# EAGLE design Adafruit OLED FeatherWing (EAGLE 6.4)
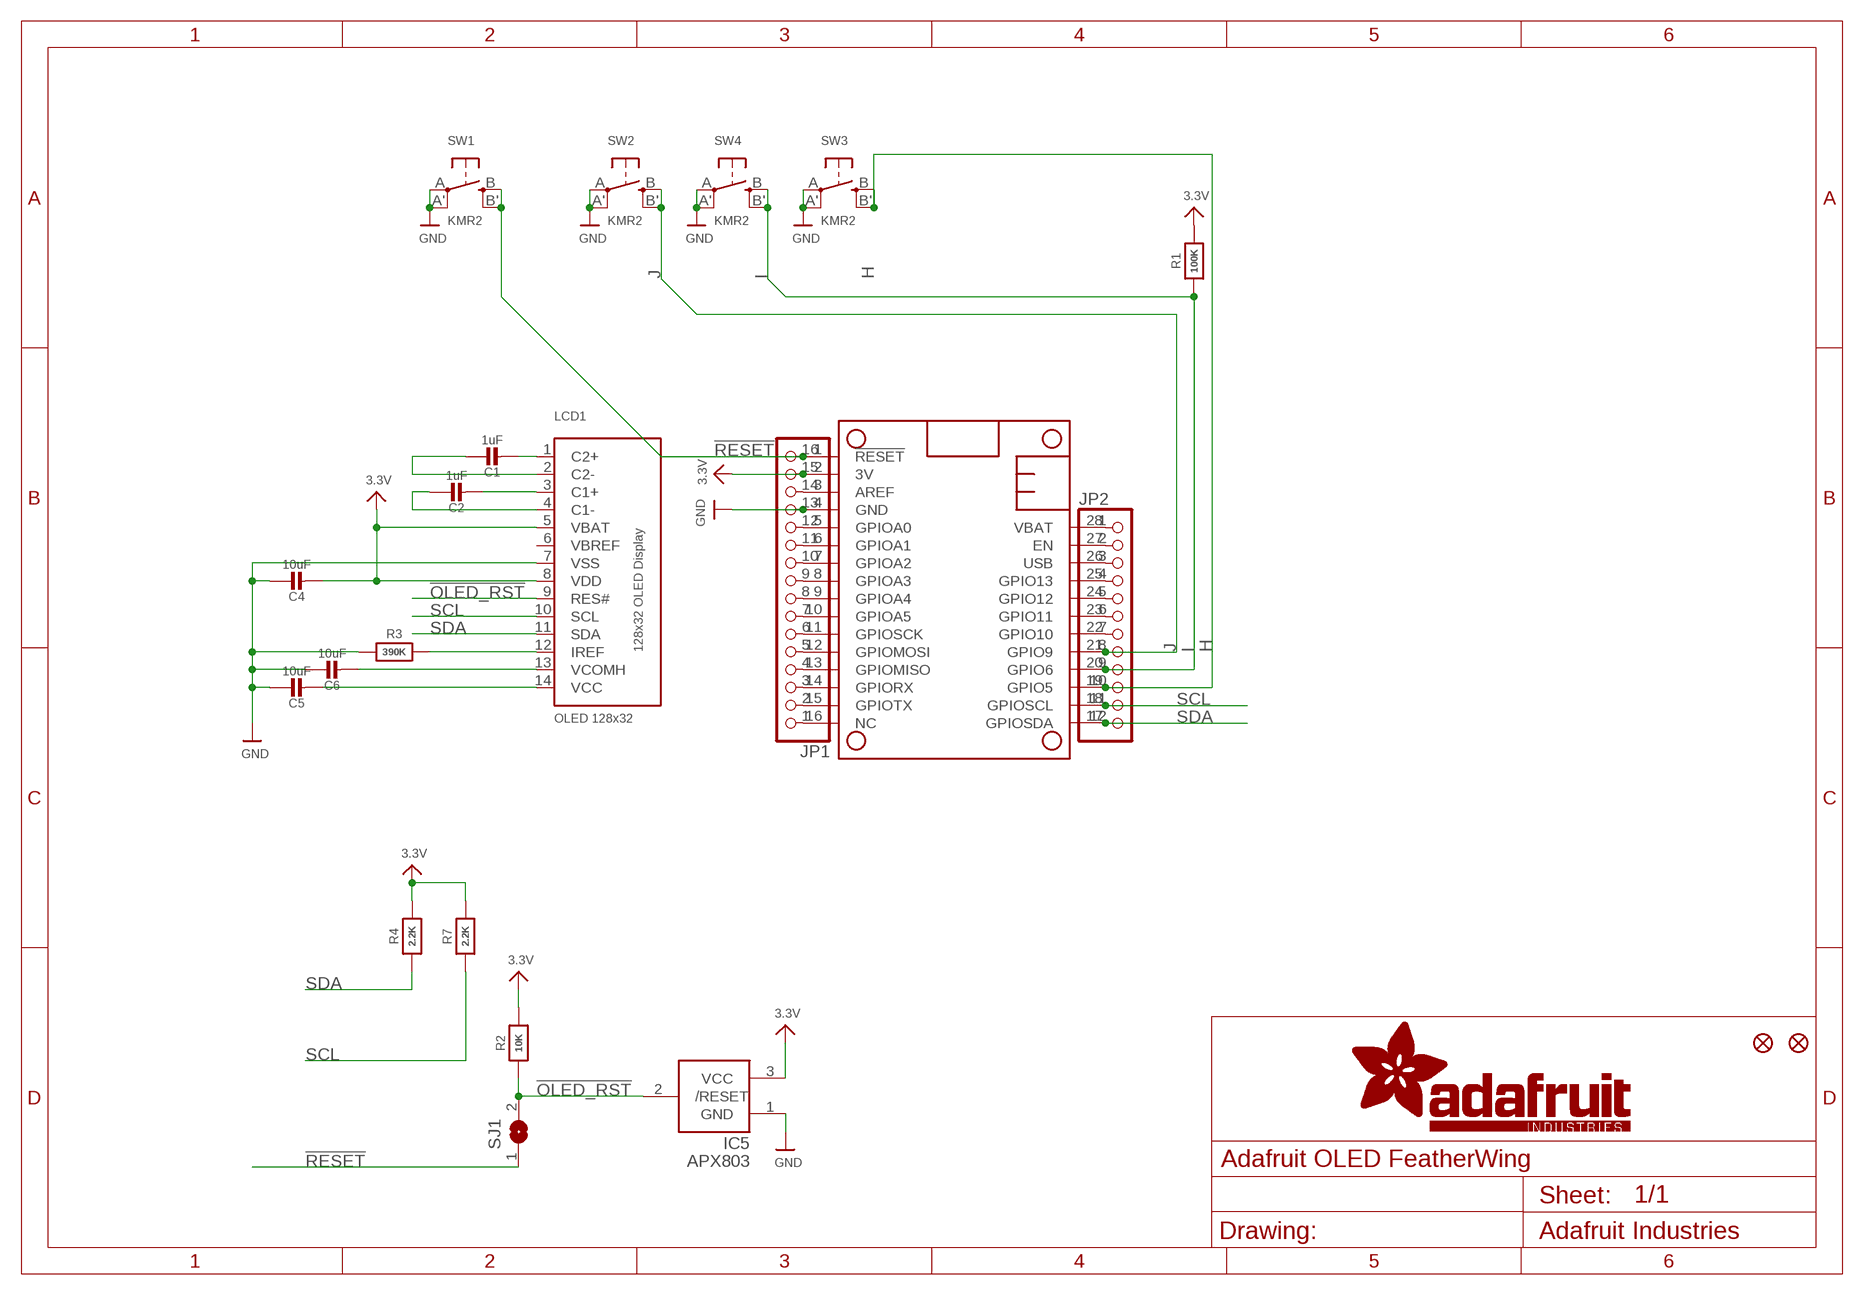
[diagram p0: schematic, sheet 1]

## Parts
C1  1uF  CAP_CERAMIC0805-NOOUTLINE  [0805-NO]
C2  1uF  CAP_CERAMIC0805-NOOUTLINE  [0805-NO]
C4  10uF  CAP_CERAMIC0805-NOOUTLINE  [0805-NO]
C5  10uF  CAP_CERAMIC0805-NOOUTLINE  [0805-NO]
C6  10uF  CAP_CERAMIC0805-NOOUTLINE  [0805-NO]
FID1  FIDUCIAL""  [FIDUCIAL_1MM]
FID2  FIDUCIAL""  [FIDUCIAL_1MM]
IC5  APX803  AXP083-SAG  [SOT23]
JP1  HEADER-1X16ROUND  [1X16_ROUND]
JP2  HEADER-1X12  [1X12_ROUND]
LCD1  OLED 128x32  DISP_OLED_UG-2832HSWEG02  [UG-2832HSWEG02_WRAPUNDER]
MS1  FEATHERWING  [FEATHERWING]
R1  100K  RESISTOR0805_NOOUTLINE  [0805-NO]
R2  10K  RESISTOR_0805MP  [_0805MP]
R3  390K  RESISTOR0805_NOOUTLINE  [0805-NO]
R4  2.2K  RESISTOR0805_NOOUTLINE  [0805-NO]
R7  2.2K  RESISTOR0805_NOOUTLINE  [0805-NO]
SJ1  SOLDERJUMPER  [SOLDERJUMPER_ARROW_NOPASTE]
SW1  KMR2  SWITCH_TACT_SMT4.6X2.8  [BTN_KMR2_4.6X2.8]
SW2  KMR2  SWITCH_TACT_SMT4.6X2.8  [BTN_KMR2_4.6X2.8]
SW3  KMR2  SWITCH_TACT_SMT4.6X2.8  [BTN_KMR2_4.6X2.8]
SW4  KMR2  SWITCH_TACT_SMT4.6X2.8  [BTN_KMR2_4.6X2.8]

## Nets
3.3V: C4.2 IC5.3(VCC) JP1.15 LCD1.5(VBAT) LCD1.8(VDD) MS1.2(3V) R1.2 R2.2 R4.2 R7.2
!OLED_RST: IC5.2(/RESET) LCD1.9(RES#) R2.1 SJ1.2
!RESET: JP1.16 MS1.1(!RESET) SJ1.1 SW1.B'(S1) SW1.B(S)
A: JP1.12 MS1.5(GPIOA0)
AREF: JP1.14 MS1.3(AREF)
B: JP1.11 MS1.6(GPIOA1)
C: JP1.10 MS1.7(GPIOA2)
D: JP1.9 MS1.8(GPIOA3)
E: JP1.8 MS1.9(GPIOA4)
EN: JP2.2 MS1.27(EN)
F: JP1.7 MS1.10(GPIOA5)
G: JP1.1 MS1.16(NC)
GND: C4.1 C5.1 C6.1 IC5.1(GND) JP1.13 LCD1.7(VSS) MS1.4(GND) R3.1 SW1.A'(P1) SW1.A(P) SW2.A'(P1) SW2.A(P) SW3.A'(P1) SW3.A(P) SW4.A'(P1) SW4.A(P)
H: JP2.10 MS1.19(GPIO5) SW3.B'(S1) SW3.B(S)
I: JP2.9 MS1.20(GPIO6) R1.1 SW4.B'(S1) SW4.B(S)
J: JP2.8 MS1.21(GPIO9) SW2.B'(S1) SW2.B(S)
K: JP2.7 MS1.22(GPIO10)
L: JP2.6 MS1.23(GPIO11)
M: JP2.5 MS1.24(GPIO12)
MISO: JP1.4 MS1.13(GPIOMISO)
MOSI: JP1.5 MS1.12(GPIOMOSI)
N: JP2.4 MS1.25(GPIO13)
N$1: C1.2 LCD1.1(C2+)
N$2: C1.1 LCD1.2(C2-)
N$3: C2.2 LCD1.3(C1+)
N$4: C2.1 LCD1.4(C1-)
N$5: C6.2 LCD1.13(VCOMH)
N$6: C5.2 LCD1.14(VCC)
N$7: LCD1.12(IREF) R3.2
RX: JP1.3 MS1.14(GPIORX)
SCK: JP1.6 MS1.11(GPIOSCK)
SCL: JP2.11 LCD1.10(SCL) MS1.18(GPIOSCL) R7.1
SDA: JP2.12 LCD1.11(SDA) MS1.17(GPIOSDA) R4.1
TX: JP1.2 MS1.15(GPIOTX)
USB: JP2.3 MS1.26(USB)
VBAT: JP2.1 MS1.28(VBAT)

## Power pins joined to a net without a drawn wire
VBREF: LCD1.6(VBREF)

## Library data of the parts
C1 C2 C4-C6 = microbuilder:CAP_CERAMIC: Ceramic Capacitors For new designs, use the packages preceded by an '_' character since they are more reliable: The following footprints should be used on most boards: _0402 - Standard footprint for regular board layouts _0603 - Standard footprint for regular board layouts _0805 - Standard footprint for regular board layouts _1206 - Standard footprint for regular board layouts For extremely tight-pitch boards where space is at a premium, the following 'micro-pitch' footprints can be used (smaller pads, no silkscreen outline, etc.): _0402MP - Micro-pitch footprint for very dense/compact boards _0603MP - Micro-pitch footprint for very dense/compact boards _0805MP - Micro-pitch footprint for very dense/compact boards _1206MP - Micro-pitch footprint for very dense/compact boards
FID1 FID2 = microbuilder:FIDUCIAL: Fiducial Alignment Points Various fiducial points for machine vision alignment.; BOM: EXCLUDE
IC5 = adafruit:AXP083
JP1 = microbuilder:HEADER-1X16: PIN HEADER
JP2 = microbuilder:HEADER-1X12
LCD1 = microbuilder:DISP_OLED_UG-2832HSWEG02: 128x32 I2C 0.91" Monochrome OLED Display
MS1 = microbuilder:FEATHERWING
R1-R4 R7 = microbuilder:RESISTOR: Resistors For new designs, use the packages preceded by an '_' character since they are more reliable: The following footprints should be used on most boards: _0402 - Standard footprint for regular board layouts _0603 - Standard footprint for regular board layouts _0805 - Standard footprint for regular board layouts _1206 - Standard footprint for regular board layouts For extremely tight-pitch boards where space is at a premium, the following 'micro-pitch' footprints can be used (smaller pads, no silkscreen outline, etc.): _0402MP - Micro-pitch footprint for very dense/compact boards _0603MP - Micro-pitch footprint for very dense/compact boards _0805MP - Micro-pitch footprint for very dense/compact boards _1206MP - Micro-pitch footprint for very dense/compact boards
SJ1 = microbuilder:SOLDERJUMPER: SMD Solder JUMPER Solder the two pads together to create a connection, or remove the solder to break it. REFLOW - Use this footprint for solder paste and reflow ovens. WAVE - Use this footprint for hand-soldering (larger pads). CLOSED - Has a trace between the two pads to ensure it is closed by default. The trace needs to be cut to disable the jumper, and can be closed again by creating a solder bridge between the two pads.; BOM: EXCLUDE
SW1-SW4 = microbuilder:SWITCH_TACT_SMT: SMT Tact Switches 6x6mm - Digikey: P12940SCT-ND KMR2 (4.6x2.8mm) - Digikey: 401-1426-1-ND EVQ-PQHB55 - Light Touch, 160GF (4.5x4.5mm) - Digikey: P8090SCT-ND KMT0 - KMT021 NGJ LHS (etc.) IP68/Waterproof - Digikey: CKN10289CT-ND

## Board
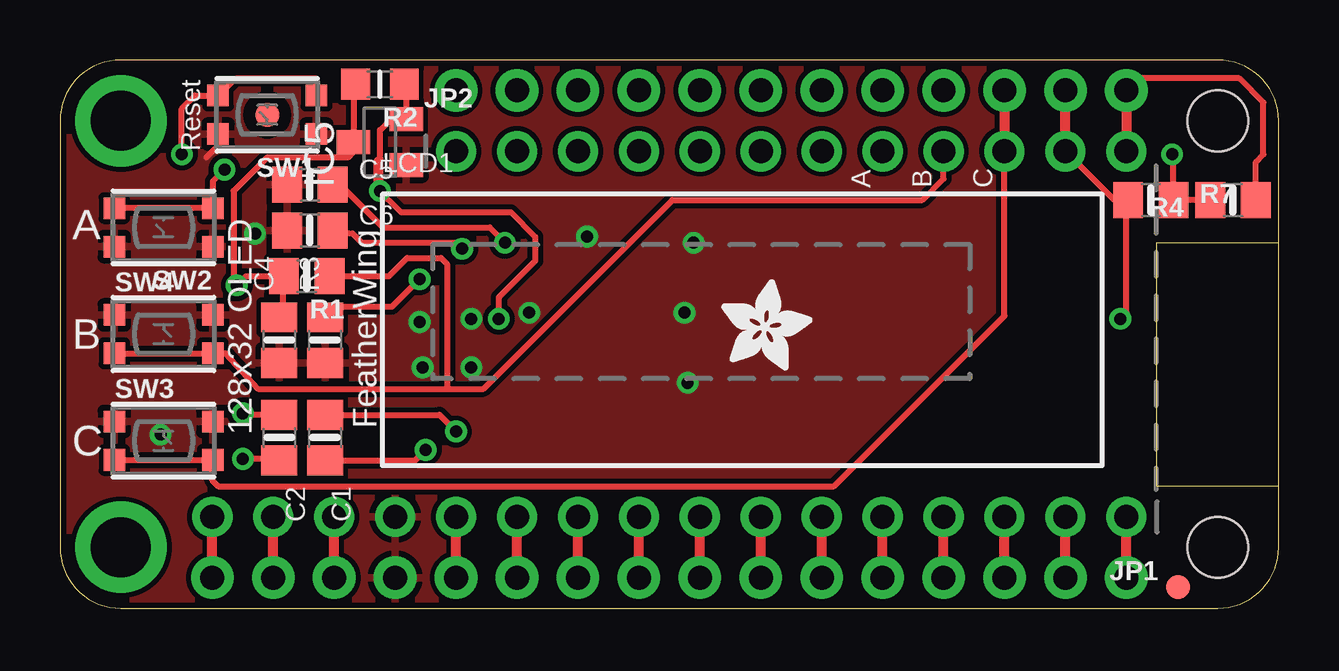
[diagram p1: board, top side]
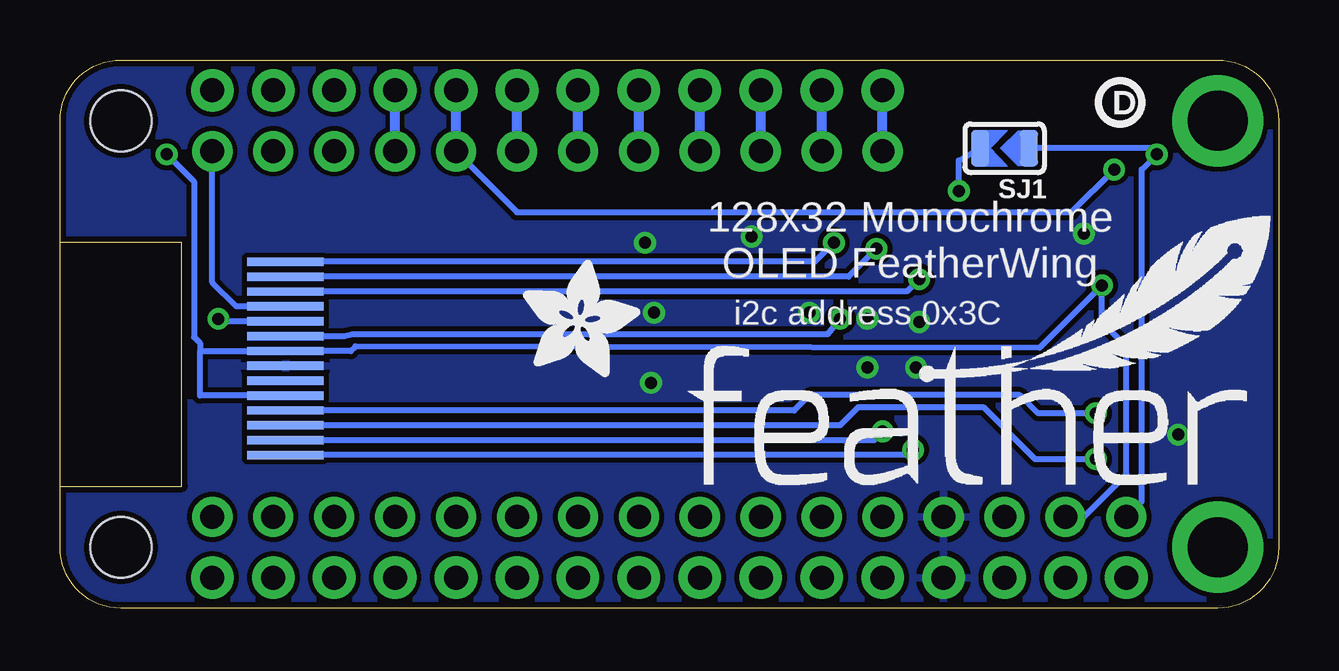
[diagram p2: board, bottom side, seen from below]

Size 50.8 x 22.86 mm. Coordinates in mm from the lower left corner, seen from the top.
Outline: 50.8,15.24 50.8,20.32 arc90 48.26,22.86 2.54,22.86 arc90 0,20.32 0,2.54 arc90 2.54,0 48.26,0 arc90 50.8,2.54 50.8,5.08 45.72,5.08 45.72,15.24 50.8,15.24
Copper layers (1*16): Top 0.035mm / dielectric 1.5mm / Bottom 0.035mm
Design rules "adafruit": minimum track width 8mil, minimum drill 15.5mil, track to track 8mil, track to pad 8mil, pad to pad 8mil, via to via 8mil, smd to smd 8mil, copper to edge 10mil, drill to drill 8mil, minimum pad ring 10mil, minimum via ring 8mil, stop-mask expansion 2mil, vias tented up to drill 20mil, thermal gap 10mil

### Footprints (pad centres in the part's own frame; a part is rotated, then mirrored left to right if it is on the bottom)
0805-NO = smd 1.24 x 1.5: 1 -0.95,0; 2 0.95,0
FIDUCIAL_1MM = smd 1 x 1: 1 0,0
SOT23 = smd 1 x 1.4: 1 -0.95,-1.1; 2 0.95,-1.1; 3 0,1.1
1X16_ROUND = drill 1 pad 1.676: 1 -19.05,0; 2 -16.51,0; 3 -13.97,0; 4 -11.43,0; 5 -8.89,0; 6 -6.35,0; 7 -3.81,0; 8 -1.27,0; 9 1.27,0; 10 3.81,0; 11 6.35,0; 12 8.89,0; 13 11.43,0; 14 13.97,0; 15 16.51,0; 16 19.05,0
1X12_ROUND = drill 1 pad 1.676: 1 -13.97,0; 2 -11.43,0; 3 -8.89,0; 4 -6.35,0; 5 -3.81,0; 6 -1.27,0; 7 1.27,0; 8 3.81,0; 9 6.35,0; 10 8.89,0; 11 11.43,0; 12 13.97,0
UG-2832HSWEG02_WRAPUNDER = smd 3.2 x 0.35 bottom: 1 -2.03,-5.3; 2 -2.03,-4.68; 3 -2.03,-4.06; 4 -2.03,-3.44; 5 -2.03,-2.82; 6 -2.03,-2.2; 7 -2.03,-1.58; 8 -2.03,-0.96; 9 -2.03,-0.34; 10 -2.03,0.28; 11 -2.03,0.9; 12 -2.03,1.52; 13 -2.03,2.14; 14 -2.03,2.76
FEATHERWING = drill 1 pad 1.778: 1 6.35,1.27; 2 8.89,1.27; 3 11.43,1.27; 4 13.97,1.27; 5 16.51,1.27; 6 19.05,1.27; 7 21.59,1.27; 8 24.13,1.27; 9 26.67,1.27; 10 29.21,1.27; 11 31.75,1.27; 12 34.29,1.27; 13 36.83,1.27; 14 39.37,1.27; 15 41.91,1.27; 16 44.45,1.27; 17 44.45,21.59; 18 41.91,21.59; 19 39.37,21.59; 20 36.83,21.59; 21 34.29,21.59; 22 31.75,21.59; 23 29.21,21.59; 24 26.67,21.59; 25 24.13,21.59; 26 21.59,21.59; 27 19.05,21.59; 28 16.51,21.59 | drill 2.5 pad 3.81: P$1 2.54,20.32; P$2 2.54,2.54 | hole 2.54: 48.26,20.32; 48.26,2.54
_0805MP = smd 1.2 x 1.3: 1 -1.016,0; 2 1.016,0
SOLDERJUMPER_ARROW_NOPASTE = smd 0.762 x 1.524: 1 -1.016,0; 2 1.016,0
BTN_KMR2_4.6X2.8 = smd 0.9 x 0.9: A 2.05,0.8; A' -2.05,0.8; B 2.05,-0.8; B' -2.05,-0.8

### Placement (x,y rotation side)
C1  11.05,7.11 270 top
C2  9.14,7.11 270 top
C4  9.14,11.18 90 top
C5  10.41,17.65 0 top
C6  10.41,15.75 0 top
FID1  8.64,20.57 0 top
FID2  46.61,0.89 0 top
IC5  13.34,19.43 90 top
JP1  25.4,3.81 180 top
JP2  30.48,19.05 0 top
LCD1  43.43,11.68 0 top
MS1  0,0 0 top
R1  10.29,13.84 180 top
R2  13.34,21.84 180 top
R3  11.05,11.18 90 top
R4  48.9,17.02 180 top
R7  45.47,17.02 0 top
SJ1  11.43,19.18 180 bottom
SW1  8.64,20.57 180 top
SW2  4.32,15.88 180 top
SW3  4.32,6.99 0 top
SW4  4.32,11.43 0 top
U$4  [FEATHERLOGO]  24.64,5.08 0 bottom
U$8  [ADAFRUIT_5MM]  31.5,9.65 0 bottom
U$14  [PCBFEAT-REV-040]  6.6,21.08 0 bottom
U$16  [ADAFRUIT_3.5MM]  27.56,9.91 0 top

### Tracks (layer width: path | path; a pad name or v marks a point on that pad's centre or on a via)
3.3V  (via drill 0.5)
  Top 0.254: C4.2 9.34,12.32 9.27,12.38 R1.2 7.75,13.84 v7.37,13.46 7.24,13.72 7.24,17.4 8.64,18.8 12,18.8 12.23,19.03 IC5.3 12.23,21.59 R2.2 | R4.2 R7.2 46.42,18.86 v46.35,18.92
  Top 0.406: MS1.2 JP1.15
  Bottom 0.254: LCD1.5 44.96,8.86 44.96,10.72 | 44.96,10.72 LCD1.8 38.68,10.72 38.48,10.92 9.98,10.85 v7.37,13.46 7.37,11.94 6.35,10.92 6.35,5.59 8.13,3.81 JP1.15 | v46.35,18.92 45.21,17.78 45.21,11.3 44.96,11.05 44.96,10.72
!OLED_RST  (via drill 0.5)
  Top 0.254: R2.1 14.44,21.59 IC5.2 14.37,20.45 13.84,20.45 13.34,19.94 13.34,18.8 | 13.34,18.8 13.21,18.67 13.21,17.53 14.22,16.51 18.8,16.51 19.81,15.49 19.81,14.48 18.29,12.95 v18.29,12.06 | 13.34,18.8 v13.34,17.4
  Bottom 0.254: LCD1.9 38.95,11.34 38.61,11.43 18.8,11.43 v18.29,12.06 | v13.34,17.4 13.34,18.67 SJ1.2
!RESET  (via drill 0.5)
  Top 0.254: SW1.B' 10.67,21.37 10.67,22.1 7.35,22.1 SW1.B 5.63,21.37 5.08,20.83 v5.08,18.92
  Top 0.406: MS1.1 JP1.16
  Bottom 0.254: JP1.16 5.71,4.45 5.71,18.29 v5.08,18.92 5.33,19.18 SJ1.1
A
  Top 0.406: MS1.5 JP1.12
AREF
  Top 0.406: MS1.3 JP1.14
B
  Top 0.406: MS1.6 JP1.11
C
  Top 0.406: MS1.7 JP1.10
D
  Top 0.406: MS1.8 JP1.9
E
  Top 0.406: MS1.9 JP1.8
EN
  Bottom 0.406: JP2.2 MS1.27
F
  Top 0.406: MS1.10 JP1.7
G
  Top 0.406: MS1.16 JP1.1
GND  (via drill 0.5)
  Top 0.254: SW1.A 6.59,19.29 6.1,18.8
  other vias: 26.16,9.4 15.11,10.03 4.19,7.24 26.42,15.24 26.04,12.32 8.13,15.62 14.99,11.94 17.14,10.03 17.14,12.06 19.56,12.32 21.97,15.49
  pour Bottom: 0,22.86 0,0 50.8,0 50.8,22.86
  pour Top: 0,22.86 0,0 50.8,0 50.8,22.86
H
  Top 0.254: SW3.B' SW3.B | SW3.B 6.64,6.18 | JP2.10 39.37,12.19 32.26,5.08 6.6,5.08 6.35,5.33 6.35,6.17 SW3.B
  Top 0.406: MS1.19 JP2.10
I
  Top 0.254: SW4.B' SW4.B 6.9,10.63 8.26,9.14 16.13,9.14 | 16.13,9.14 17.65,9.14 25.53,17.02 35.94,17.02 36.83,17.91 JP2.9 | R1.1 13.72,13.84 14.48,14.61 15.88,14.61 16.13,14.35 16.13,9.14
  Bottom 0.406: JP2.9 MS1.20
J  (via drill 0.5)
  Top 0.254: SW2.B SW2.B' 6.37,17.8 v6.86,18.29
  Bottom 0.254: JP2.8 31.75,16.51 8.64,16.51 v6.86,18.29
  Bottom 0.406: JP2.8 MS1.21
K
  Bottom 0.406: JP2.7 MS1.22
L
  Bottom 0.406: JP2.6 MS1.23
M
  Bottom 0.406: JP2.5 MS1.24
MISO
  Top 0.406: MS1.13 JP1.4
MOSI
  Top 0.406: MS1.12 JP1.5
N
  Bottom 0.406: JP2.4 MS1.25
N$1  (via drill 0.5)
  Top 0.254: C1.2 14.8,6.16 v15.24,6.6
  Bottom 0.254: v15.24,6.6 15.46,6.38 LCD1.1
N$2  (via drill 0.5)
  Top 0.254: C1.1 15.81,8.06 v16.51,7.37
  Bottom 0.254: v16.51,7.37 16.87,7 LCD1.2
N$3  (via drill 0.5)
  Top 0.254: C2.2 9.08,6.22 v7.62,6.22
  Bottom 0.254: LCD1.3 18.28,7.62 17.53,8.38 12.32,8.38 10.16,6.22 v7.62,6.22
N$4  (via drill 0.5)
  Top 0.254: C2.1 7.87,8.06 v7.62,8.13
  Bottom 0.254: v7.62,8.13 10.03,8.13 10.79,8.89 19.56,8.89 20.2,8.24 LCD1.4
N$5  (via drill 0.5)
  Top 0.254: C6.2 12.19,15.62 12.57,15.24 16.51,15.24 v16.76,14.99
  Bottom 0.254: v16.76,14.99 17.93,13.82 LCD1.13
N$6  (via drill 0.5)
  Top 0.254: C5.2 11.94,17.4 13.46,15.88 17.91,15.88 v18.54,15.24
  Bottom 0.254: v18.54,15.24 19.34,14.44 LCD1.14
N$7  (via drill 0.5)
  Top 0.254: R3.2 11.36,12.13 11.81,12.57 13.84,12.57 v14.99,13.72
  Bottom 0.254: v14.99,13.72 15.5,13.2 LCD1.12
RX
  Top 0.406: MS1.14 JP1.3
SCK
  Top 0.406: MS1.11 JP1.6
SCL  (via drill 0.5)
  Top 0.254: JP2.11 43.94,17.02 R7.1 44.45,16.95 44.45,12.32 v44.2,12.06
  Top 0.406: JP2.11 MS1.18
  Bottom 0.254: LCD1.10 44.09,11.96 v44.2,12.06
SDA
  Top 0.254: R4.1 49.84,18.6 50.16,18.92 50.16,21.08 49.15,22.1 44.96,22.1 MS1.17
  Top 0.406: MS1.17 JP2.12
  Bottom 0.254: LCD1.11 43.45,12.58 44.45,13.59 JP2.12
TX
  Top 0.406: MS1.15 JP1.2
USB
  Bottom 0.406: JP2.3 MS1.26
VBAT
  Bottom 0.406: JP2.1 MS1.28

### Text on the board
tPlace: Reset | A | B | C | A | B | 128x32 OLED | FeatherWing | C
bPlace: 128x32 Monochrome / OLED FeatherWing | i2c address 0x3C